# Altium schematic sheet GPIO_EXT.SchDoc
size B
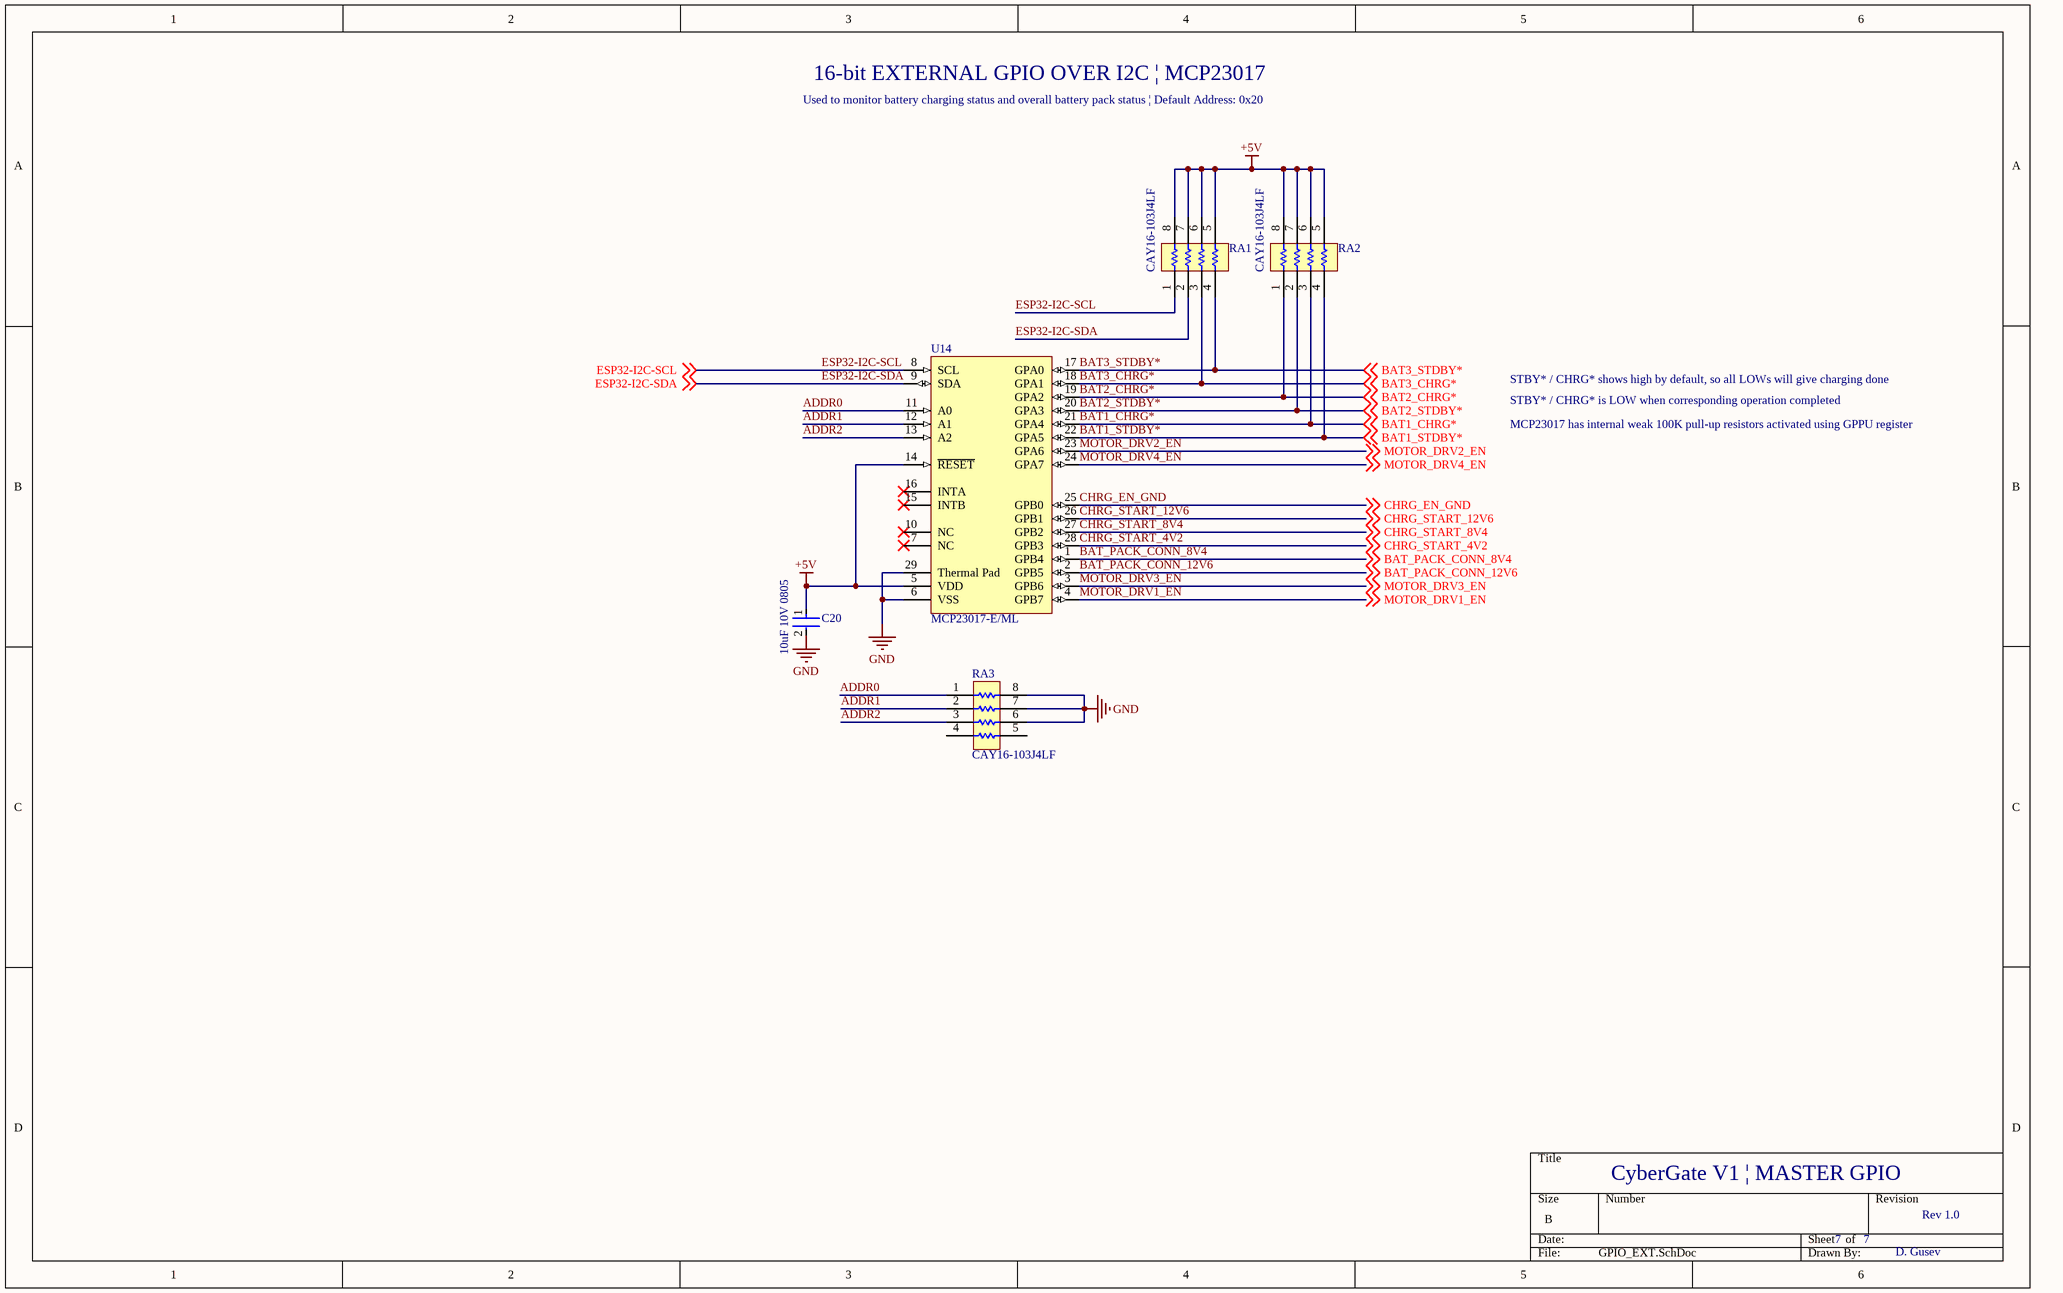
[diagram p0: GPIO_EXT.SchDoc]

## Parts
C20  10uF 10V 0805  [FP-C0805C-DG-MFG]
RA1  CAY16-103J4LF  [BOUR-CAY16-J4_V]
RA2  CAY16-103J4LF  [BOUR-CAY16-J4_V]
RA3  CAY16-103J4LF  [BOUR-CAY16-J4_V]
U14  MCP23017-E/ML  [MCP23017]

## Nets
+5V: C20.1 RA1.5 RA1.6 RA1.7 RA1.8 RA2.5 RA2.6 RA2.7 RA2.8 U14.5(VDD) U14.14(~{RESET})
GND: C20.2 RA3.6 RA3.7 RA3.8 U14.6(VSS) U14.29(Thermal_Pad)
ADDR0: RA3.1 U14.11(A0)
ADDR1: RA3.2 U14.12(A1)
ADDR2: RA3.3 U14.13(A2)
BAT1_CHRG*: RA2.3 U14.21(GPA4) ; off-sheet BAT1_CHRG*
BAT1_STDBY*: RA2.4 U14.22(GPA5) ; off-sheet BAT1_STDBY*
BAT2_CHRG*: RA2.1 U14.19(GPA2) ; off-sheet BAT2_CHRG*
BAT2_STDBY*: RA2.2 U14.20(GPA3) ; off-sheet BAT2_STDBY*
BAT3_CHRG*: RA1.3 U14.18(GPA1) ; off-sheet BAT3_CHRG*
BAT3_STDBY*: RA1.4 U14.17(GPA0) ; off-sheet BAT3_STDBY*
BAT_PACK_CONN_8V4: U14.1(GPB4) ; off-sheet BAT_PACK_CONN_8V4
BAT_PACK_CONN_12V6: U14.2(GPB5) ; off-sheet BAT_PACK_CONN_12V6
CHRG_EN_GND: U14.25(GPB0) ; off-sheet CHRG_EN_GND
CHRG_START_4V2: U14.28(GPB3) ; off-sheet CHRG_START_4V2
CHRG_START_8V4: U14.27(GPB2) ; off-sheet CHRG_START_8V4
CHRG_START_12V6: U14.26(GPB1) ; off-sheet CHRG_START_12V6
ESP32-I2C-SCL: RA1.1 U14.8(SCL) ; off-sheet ESP32-I2C-SCL
ESP32-I2C-SDA: RA1.2 U14.9(SDA) ; off-sheet ESP32-I2C-SDA
MOTOR_DRV1_EN: U14.4(GPB7) ; off-sheet MOTOR_DRV1_EN
MOTOR_DRV2_EN: U14.23(GPA6) ; off-sheet MOTOR_DRV2_EN
MOTOR_DRV3_EN: U14.3(GPB6) ; off-sheet MOTOR_DRV3_EN
MOTOR_DRV4_EN: U14.24(GPA7) ; off-sheet MOTOR_DRV4_EN

Not connected (* = marked no-connect by the designer): RA3 4 5; U14 7(NC)* 10(NC)* 15(INTB)* 16(INTA)*

## Notes on the sheet
- 16-bit EXTERNAL GPIO OVER I2C | MCP23017
- Used to monitor battery charging status and overall battery pack status | Default Address: 0x20
- STBY* / CHRG* shows high by default, so all LOWs will give charging done
- STBY* / CHRG* is LOW when corresponding operation completed
- MCP23017 has internal weak 100K pull-up resistors activated using GPPU register
- CyberGate V1 | MASTER GPIO
- 7
- Rev 1.0
- D. Gusev

## Library data of the parts
C20 = CMP-2007-03243-2: CAP CER 10UF 10V X5R 0805; Manufacturer Part Number: C0805C106K8PACTU; Manufacturer: Kemet; 3DS Part Number: 220-00001; Tolerance: 10%; Temperature Coefficient: 15%; Material: Ceramic; Device Class L2: Capacitors; Device Class L1: Passive Components; ComponentLink2URL: https://content.kemet.com/datasheets/KEM_C1006_X5R_SMD.pdf; Height: 1.4mm; Lead Free: Yes; Digikey Description: CAP CER 10UF 10V X5R 0805; Octopart: https://octopart.com/c0805c106k8pactu-kemet-98697; Capacitance: 10uF; Value: 10uF; Temperature Range Low: -55°C; Temperature: -55°C to +85°C; Automotive: No; Mouser Description: CAP CER 10UF 10V X5R 0805; Ipc Land Pattern Name: CAPC200125X125; Temperature Range High: +85°C; Voltage: 10V; RoHS: TRUE; Device Class L3: Ceramic Capacitors; ComponentLink2Description: Datasheet; Voltage Rating: 10V; Package: C0805C-DG; Temperature Characteristic: X5R; Category: Cap
RA1-RA3 = CMP-1747-00005-1: Chip Resistor Array, 10 KOhm, +/- 5%, 62.5 mW, -55 to 125 degC, 8-Pin SMD, RoHS, Tape and Reel; Power Rating: 100 mW; Case\Package: 0603; Voltage Rating: 75 V; Tolerance: 1%; Resistance: 220 Ohm; Packaging: Tape and Reel; Min Operating Temperature: -55 degC; Pins: 2; Radiation Hardening: No; DatasheetVersion: Jan-15; Length: 0.063 inch; RoHSCompliant: true; Mount: Surface Mount; ComponentLink1Description: Manufacturer URL; ComponentLink1URL: http://www.bourns.com/; Weight: 7.1E-05 oz; ComponentLink2URL: http://www.bourns.com/docs/Product-Datasheets/CATCAY.pdf; PackageReference: CAY16-J4; Width: 0.031 inch; Case Code (Imperial): 0603; Case Code (Metric): 1608; REACH SVHC: Yes; Max Operating Temperature: 155 degC; ComponentLink2Description: Datasheet; Height: 0.022 inch; PackageDescription: 8-Pin Surface Mount Device, Body 1.6 x 3.2 mm, Pitch 0.8 mm
U14 = MCP23017: 16-Bit I/O Expander with Serial Interface, 28-Pin QFN, Extended Temperature; ComponentLink1URL: http://www.microchip.com/; ComponentLink3Description: Package Specification; PackageReference: QFN-ML28; PackageVersion: revBB, Aug-2009; PackageDescription: 28-Lead Plastic Quad Flat, No Lead Package (ML) - 6x6 mm Body [QFN] with 0.55 mm Contact Length; DatasheetVersion: revB, Feb-2007; ComponentLink1Description: Manufacturer URL; RevisionNote: URLs added.; ComponentLink2Description: Datasheet; Code_JEDEC: MO-220; ComponentLink3URL: http://www.microchip.com/stellent/groups/techpub_sg/documents/packagingspec/en012702.pdf; ComponentLink2URL: http://ww1.microchip.com/downloads/en/DeviceDoc/21952b.pdf